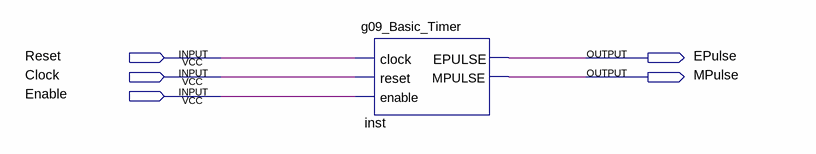
[diagram p0: schematic sheet]
// Quartus schematic g09_Basic_Timer.bdf as structural Verilog: 1 symbols, 5 pins
module g09_Basic_Timer (
  input  Reset,
  input  Clock,
  input  Enable,
  output EPulse,
  output MPulse
);

  g09_Basic_Timer inst (.clock(Reset), .reset(Clock), .enable(Enable), .EPULSE(EPulse), .MPULSE(MPulse));
endmodule
